# EasyEDA Pro project 课设作业.eprj, board PCB1
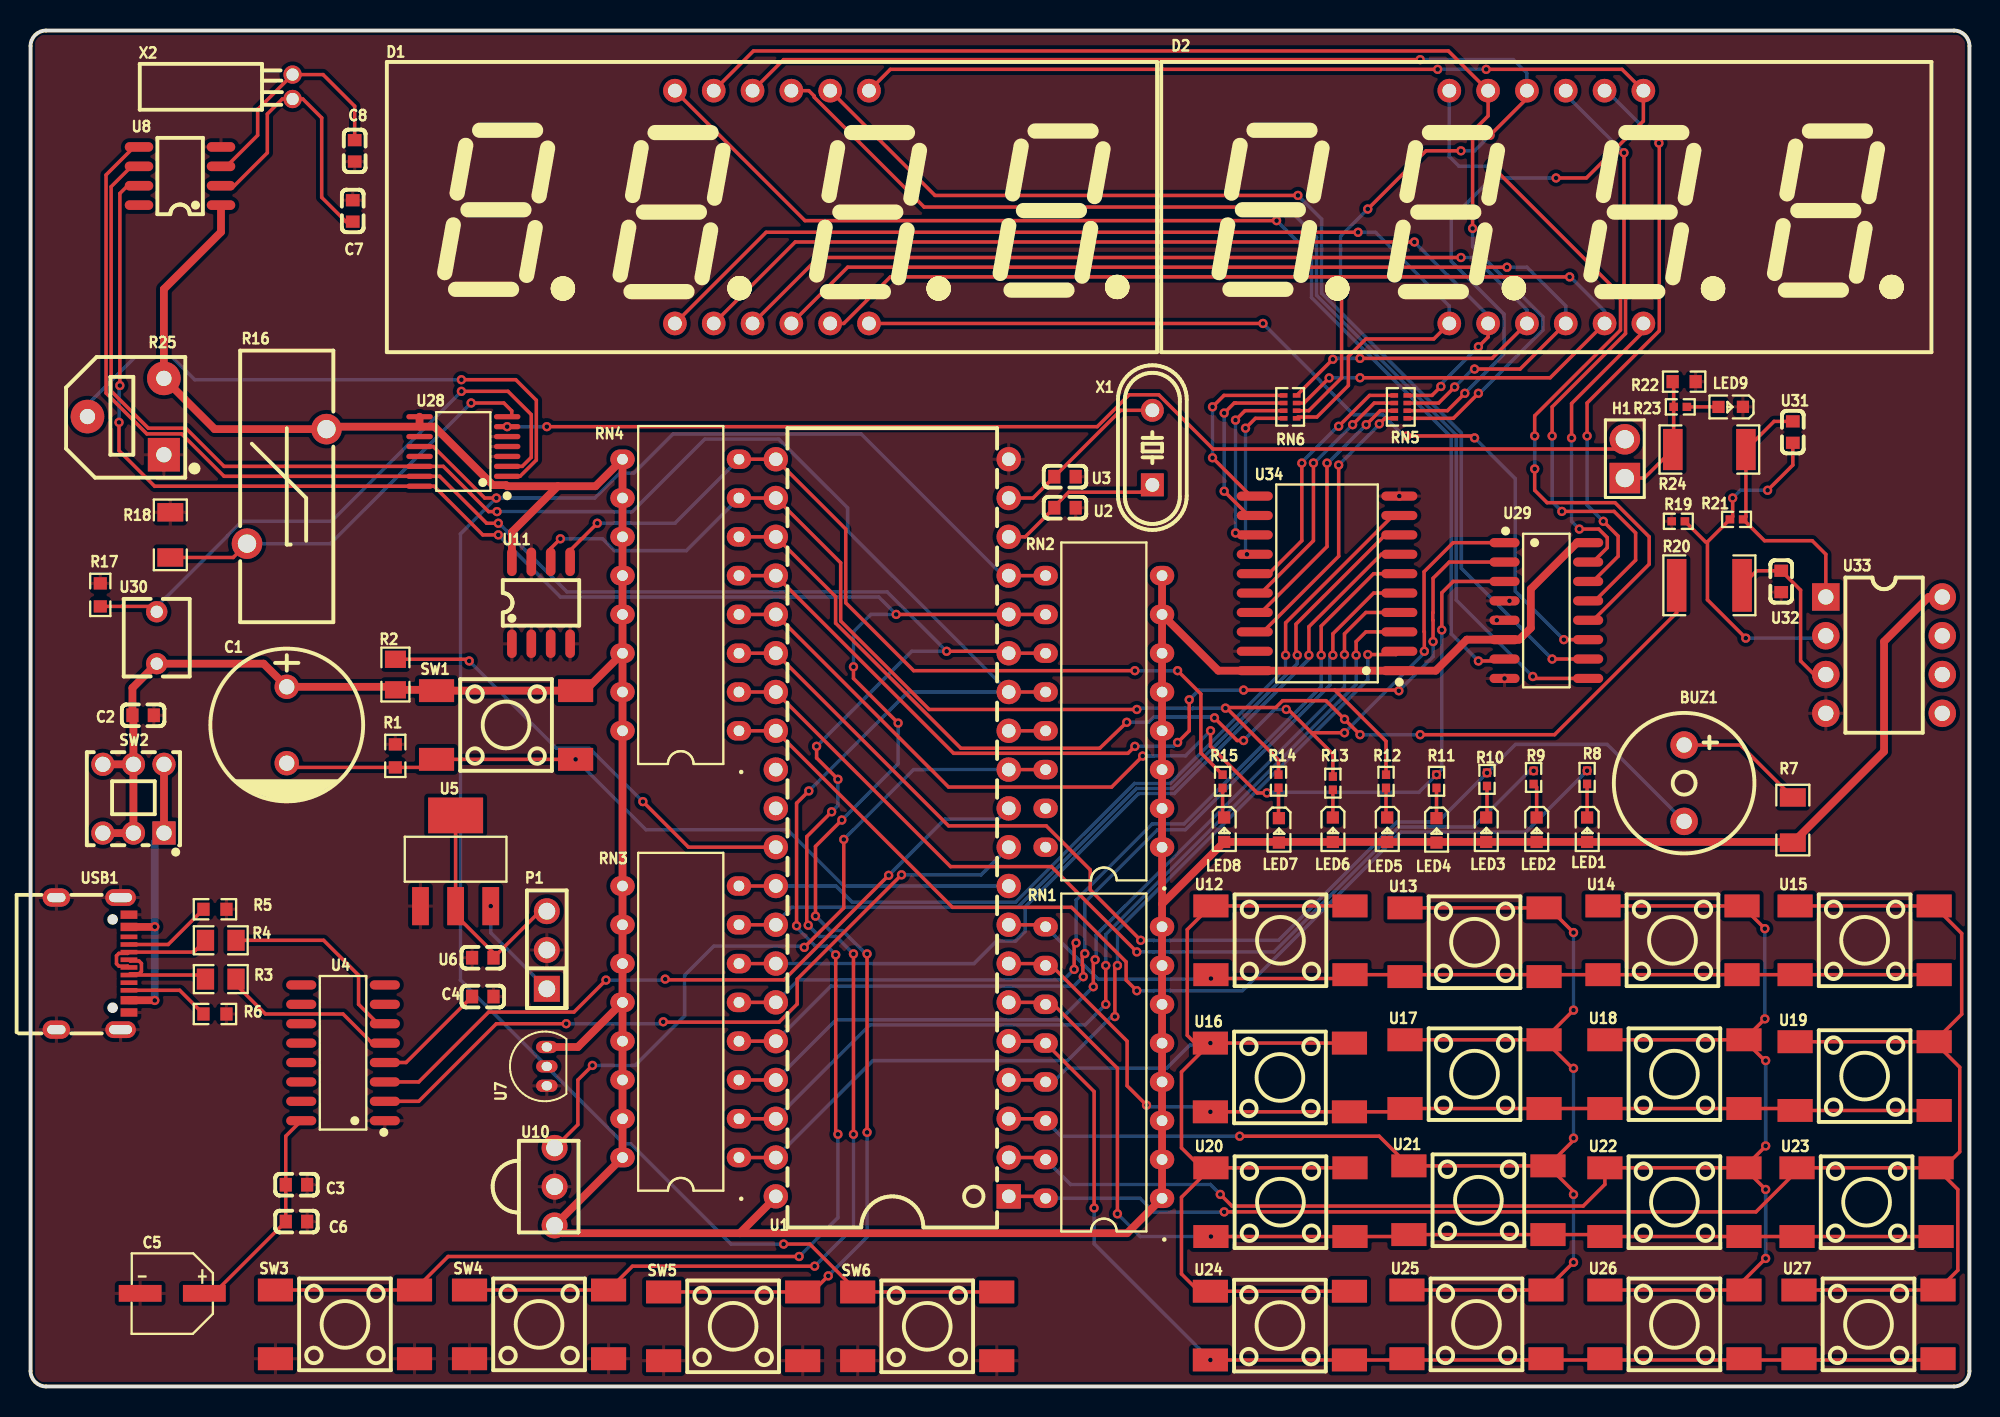
[diagram p1: board, top side]
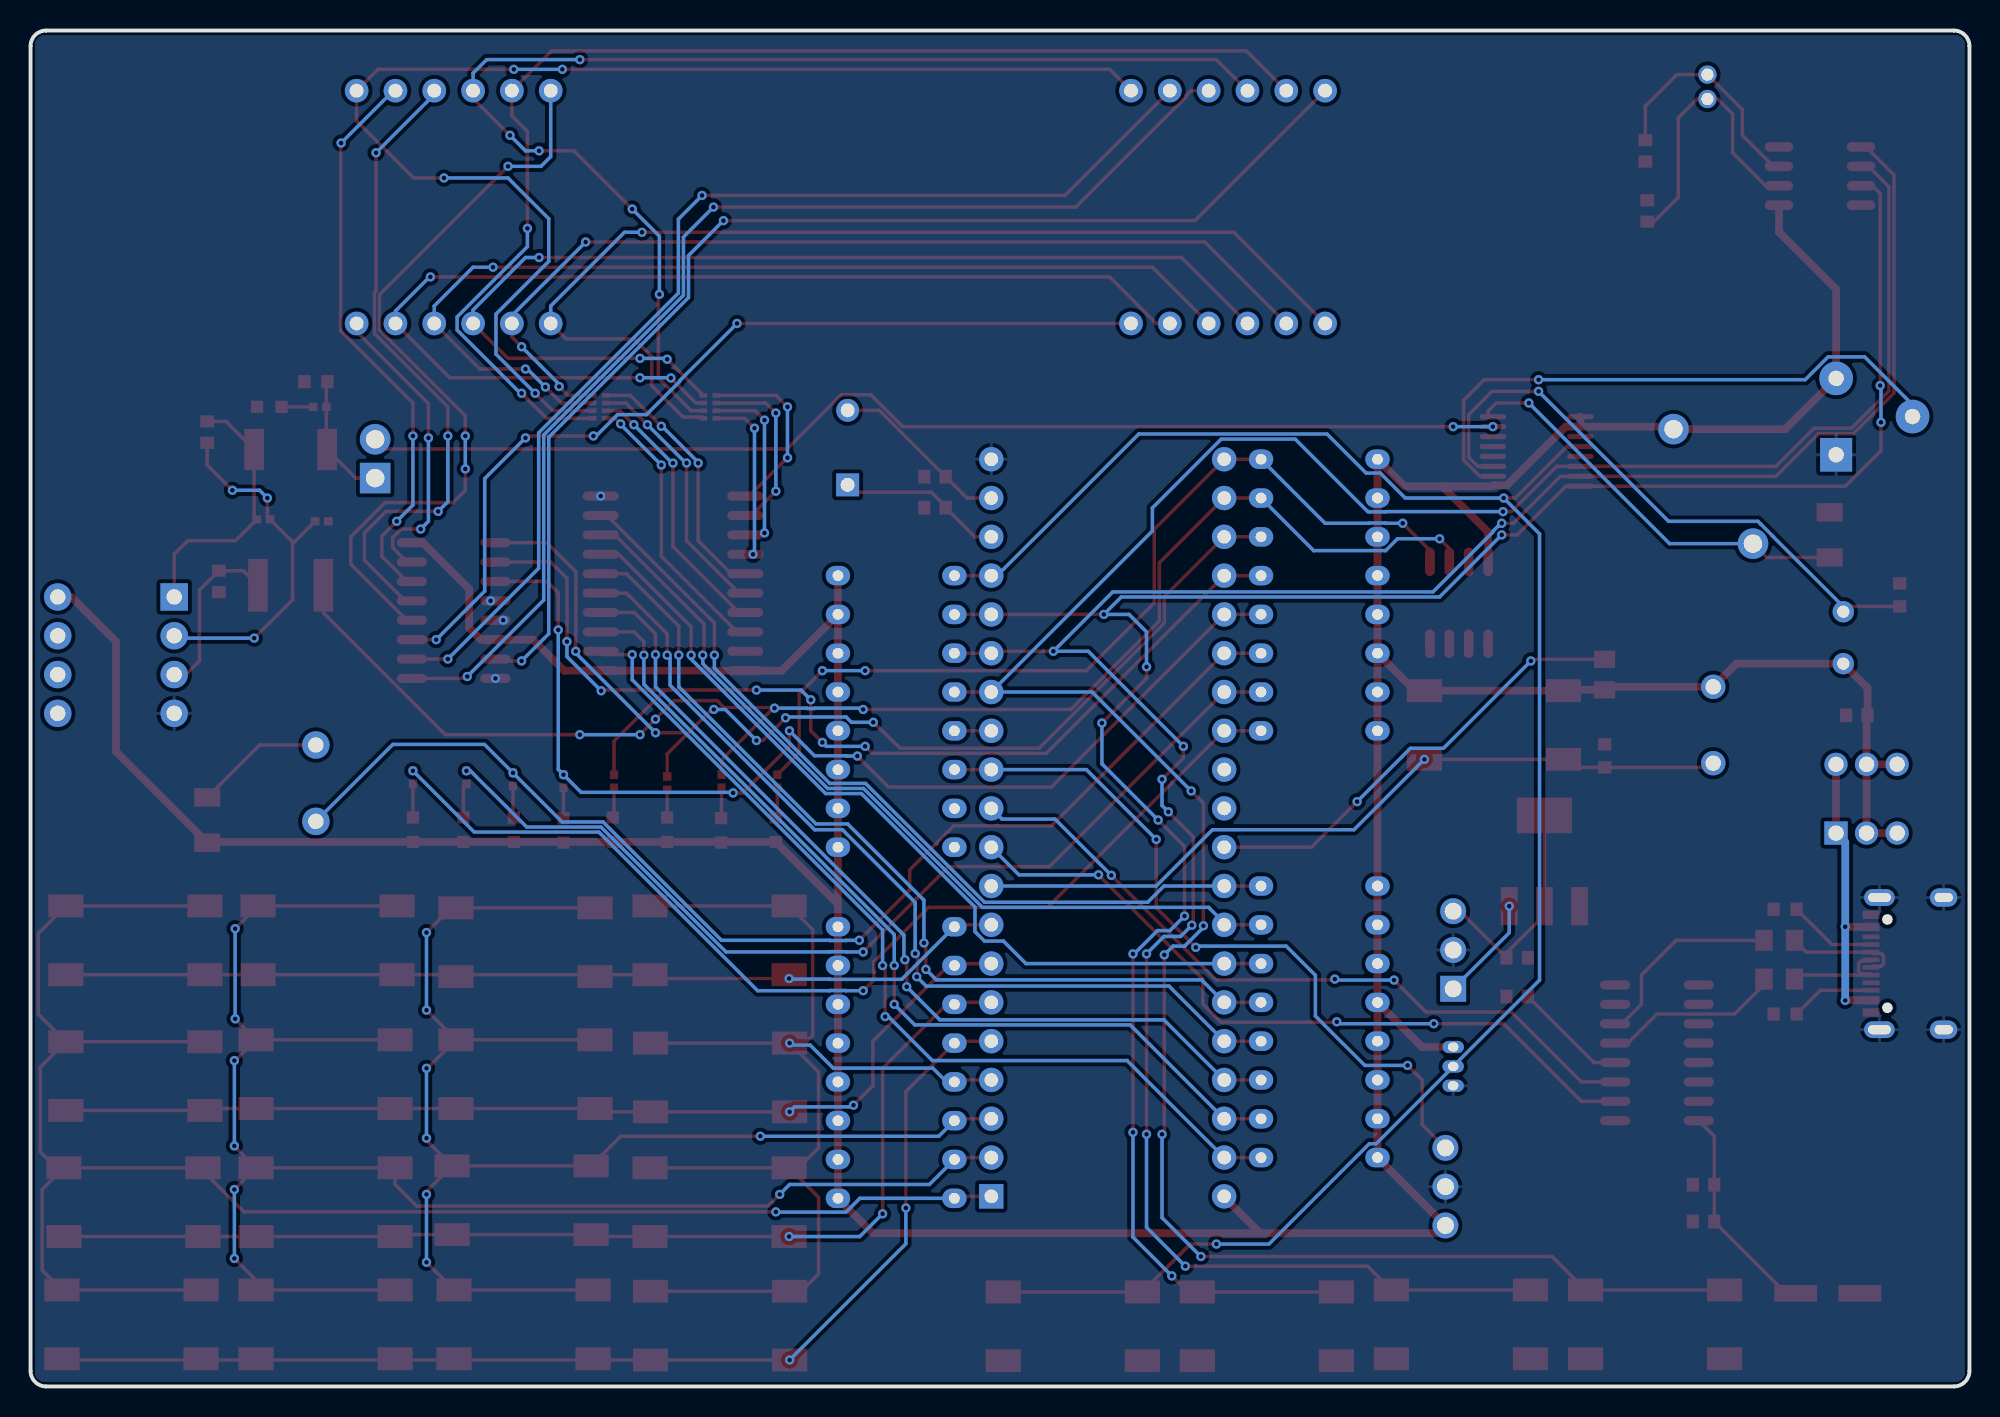
[diagram p2: board, bottom side, seen from below]

Outline 126.87 x 88.77 mm; copper layers: Top Layer, Bottom Layer. Coordinates in mm from the lower left corner of the outline.
Outline path: 0,87.76 0,1.02 arc(0.3,0.3) 1.02,0 125.86,0 arc(126.58,0.3) 126.87,1.02 126.87,87.76 arc(126.58,88.48) 125.86,88.77 1.02,88.77 arc(0.3,88.48) 0,87.76
Stack: Top Layer 0.035mm / Dielectric1 1.51mm FR4 er 4.5 / Bottom Layer 0.035mm

## Design rules (mm)
template: JLCPCB Capability(Two Layers Board)
spacing copperThickness1oz (default): track to track 0.102, other pairs 0.152 to 0.3
spacing copperThickness2oz: track to track 0.203, other pairs 0.152 to 0.3
track width copperThickness1oz (default): min 0.127, default 0.254, max 2.54
track width copperThickness2oz: min 0.203, default 0.254, max 2.54
differential pair differentialPair (default): width min 0.127, default 0.254, max 2.54; gap min 0.152, default 0.152
via viaSize (default): diameter min 0.5, default 0.61, max 10; hole min 0.3, default 0.305, max 6.3

## Placement (name value [footprint] x y rotation side)
BUZ1  蜂鸣器  [BUZ-TH_BD9.0-P5.00-D0.6-FD]  108.2 39.5 270 top
C1  10uF  [CAP-TH_BD10.0-P5.00-D0.6-FD_1]  16.76 43.31 270 top
C2  100nF  [C0603]  7.37 43.94 0 top
C3  100nF  [C0603]  17.4 13.21 0 top
C4  10nF  [C0603]  29.59 25.53 0 top
C5  22uF  [CAP-SMD_BD5.0-L5.3-W5.3-LS6.0-FD-H5.7]  9.27 6.1 180 top
C6  100nF  [C0603]  17.4 10.8 180 top
C7  22pF  [C0603]  21.08 76.96 90 top
C8  22pF  [C0603]  21.21 80.9 270 top
D1  FJ5461AH 红色  [LED-SEG-TH_FJ5461AH]  48.51 77.22 0 top
D2  FJ5461AH 红色  [LED-SEG-TH_FJ5461AH]  99.19 77.22 0 top
H1  PZ254V-11-02P  [HDR-TH_2P-P2.54-V-M]  104.32 60.74 90 top
LED1  LTST-C190KSKT  [LED0603-RD]  101.85 36.45 270 top
LED2  LTST-C190KSKT  [LED0603-RD]  98.55 36.45 270 top
LED3  LTST-C190KSKT  [LED0603-RD]  95.25 36.45 270 top
LED4  LTST-C190KSKT  [LED0603-RD]  92 36.41 270 top
LED5  LTST-C190KSKT  [LED0603-RD]  88.77 36.45 270 top
LED6  LTST-C190KSKT  [LED0603-RD]  85.22 36.45 270 top
LED7  LTST-C190KSKT  [LED0603-RD]  81.69 36.41 270 top
LED8  LTST-C190KSKT  [LED0603-RD]  78.1 36.45 270 top
LED9  XL-1608SURC-06  [LED0603-RD_RED]  111.25 64.14 180 top
P1  TXM_3  [HDR-TH_3P-P2.54-V-M-A]  33.78 28.58 90 top
R1  10K  [R0603]  23.87 41.28 90 top
R2  4.7kΩ  [R0805]  23.88 46.61 270 top
R3  27Ω  [R0805]  12.45 26.67 0 top
R4  27Ω  [R0805]  12.45 29.21 0 top
R5  5.1kΩ  [R0603]  12.06 31.24 0 top
R6  5.1kΩ  [R0603]  12.06 24.38 0 top
R7  100Ω  [R1206]  115.32 37.08 270 top
R8  470Ω  [R0402]  101.85 39.88 270 top
R9  470Ω  [R0402]  98.35 39.87 270 top
R10  470Ω  [R0402]  95.3 39.75 270 top
R11  470Ω  [R0402]  92 39.62 270 top
R12  470Ω  [R0402]  88.7 39.62 270 top
R13  470Ω  [R0402]  85.22 39.5 270 top
R14  470Ω  [R0402]  81.66 39.62 270 top
R15  470Ω  [R0402]  78 39.62 270 top
R16  WTR15D050MC3BW  [RES-TH_L17.5-W6.0-P7.50-D0.8-S5.20]  16.76 58.93 90 top
R17  10K  [R0603]  4.56 51.82 270 top
R18  100kΩ  [R1206]  9.14 55.75 270 top
R19  470Ω  [R0402]  107.82 56.64 0 top
R20  51kΩ  [R1812]  109.85 52.45 0 top
R21  470Ω  [R0402]  111.63 56.77 0 top
R22  4.7kΩ  [R0603]  108.2 65.79 180 top
R23  470Ω  [R0402]  107.95 64.14 180 top
R24  330Ω  [R2010]  109.85 61.34 180 top
R25  10kΩ  [RES-ADJ-SMD_RM065-V1]  6.22 63.5 90 top
RN1  10kΩ  [DIP-16_L22.0-W6.7-P2.54-LS7.6-BL]  70.23 21.21 90 top
RN2  10kΩ  [DIP-16_L22.0-W6.7-P2.54-LS7.6-BL]  70.23 44.2 90 top
RN3  10kΩ  [DIP-16_L22.0-W6.7-P2.54-LS7.6-BL]  42.55 23.88 90 top
RN4  10kΩ  [DIP-16_L22.0-W6.7-P2.54-LS7.6-BL]  42.55 51.82 90 top
RN5  100Ω  [RES-ARRAY-SMD_0402-8P-L2.0-W1.0-BL]  89.66 64.14 90 top
RN6  100Ω  [RES-ARRAY-SMD_0402-8P-L2.0-W1.0-BL]  82.42 64.14 90 top
SW1  KH-6X6X5H-STM  [SW-SMD_4P-L6.0-W6.0-P4.50-LS9.0_H5.0]  31.11 43.31 0 top
SW2  5.8 ZSGT  [SW-TH_5.8ZSGT]  6.73 38.48 0 top
SW3  KH-6X6X5H-STM  [SW-SMD_4P-L6.0-W6.0-P4.50-LS9.0_H5.0]  20.57 4.06 0 top
SW4  KH-6X6X5H-STM  [SW-SMD_4P-L6.0-W6.0-P4.50-LS9.0_H5.0]  33.27 4.06 0 top
SW5  KH-6X6X5H-STM  [SW-SMD_4P-L6.0-W6.0-P4.50-LS9.0_H5.0]  45.97 3.94 0 top
SW6  KH-6X6X5H-STM  [SW-SMD_4P-L6.0-W6.0-P4.50-LS9.0_H5.0]  58.67 3.94 0 top
U1  STC89C52RC-40I-PDIP40  [DIP-40_L52.0-W13.7-P2.54-LS15.2-BL]  56.39 36.58 90 top
U2  33pF  [C0603]  67.69 57.53 180 top
U3  33pF  [C0603]  67.69 59.56 0 top
U4  CH340G  [SOIC-16_L9.9-W3.9-P1.27-LS6.0-BL]  20.45 21.84 90 top
U5  AMS1117-3.3  [SOT-223-3_L6.5-W3.4-P2.30-LS7.0-BR]  27.81 34.42 270 top
U6  100nF  [C0603]  29.59 28.07 0 top
U7  DS18B20  [TO-92-3_L4.6-W3.6-P1.27-L-1]  33.78 20.96 90 top
U8  DS1302-TD  [SOP-8_L4.9-W3.9-P1.27-LS6.0-BL]  9.78 79.25 90 top
U10  HS0038B  [OPTO-TH_HS0038B-A]  34.29 13.08 90 top
U11  24C02  [SOP-8_L4.9-W3.9-P1.27-LS6.0-BL]  33.4 51.31 0 top
U12  按键  [SW-SMD_4P-L6.0-W6.0-P4.50-LS9.0-2]  81.79 29.21 0 top
U13  按键  [SW-SMD_4P-L6.0-W6.0-P4.50-LS9.0-2]  94.49 29.08 0 top
U14  按键  [SW-SMD_4P-L6.0-W6.0-P4.50-LS9.0-2]  107.44 29.21 0 top
U15  按键  [SW-SMD_4P-L6.0-W6.0-P4.50-LS9.0-2]  120.01 29.21 0 top
U16  按键  [SW-SMD_4P-L6.0-W6.0-P4.50-LS9.0-2]  81.75 20.23 0 top
U17  按键  [SW-SMD_4P-L6.0-W6.0-P4.50-LS9.0-2]  94.49 20.45 0 top
U18  按键  [SW-SMD_4P-L6.0-W6.0-P4.50-LS9.0-2]  107.57 20.45 0 top
U19  按键  [SW-SMD_4P-L6.0-W6.0-P4.50-LS9.0-2]  120.01 20.32 0 top
U20  按键  [SW-SMD_4P-L6.0-W6.0-P4.50-LS9.0-2]  81.79 12.07 0 top
U21  按键  [SW-SMD_4P-L6.0-W6.0-P4.50-LS9.0-2]  94.74 12.19 0 top
U22  按键  [SW-SMD_4P-L6.0-W6.0-P4.50-LS9.0-2]  107.57 12.07 0 top
U23  按键  [SW-SMD_4P-L6.0-W6.0-P4.50-LS9.0-2]  120.14 12.07 0 top
U24  按键  [SW-SMD_4P-L6.0-W6.0-P4.50-LS9.0-2]  81.75 3.98 0 top
U25  按键  [SW-SMD_4P-L6.0-W6.0-P4.50-LS9.0-2]  94.62 4.06 0 top
U26  按键  [SW-SMD_4P-L6.0-W6.0-P4.50-LS9.0-2]  107.57 4.06 0 top
U27  按键  [SW-SMD_4P-L6.0-W6.0-P4.50-LS9.0-2]  120.27 4.06 0 top
U28  XPT2046  [TSSOP-16_L5.0-W4.4-P0.65-LS6.4-BL]  28.32 61.21 90 top
U29  74HC138  [SOIC-16_L9.9-W3.9-P1.27-LS6.0-BL]  99.19 50.8 270 top
U30  光敏电阻-5MM  [RES-TH_L4.9-W4.3-P3.4]  8.25 49.02 90 top
U31  100nF  [C0603]  115.32 62.48 90 top
U32  100nF  [C0603]  114.55 52.71 90 top
U33  LM358P  [DIP-8_L9.7-W6.4-P2.54-LS7.6-BL]  121.28 47.88 270 top
U34  74HC245D653  [SOIC-20_L13.0-W7.6-P1.27-LS10.3-BL]  84.84 52.58 90 top
USB1  TYPE-C 16PIN 2MD(073)  [USB-C-SMD_TYPE-C-6PIN-2MD-073]  4.06 27.69 270 top
X1  11.0592MHz  [HC-49US_L11.5-W4.5-P4.88]  73.41 61.47 90 top
X2  32.768kHz  [OSC-TH_BD3.1-P0.8-D0.3]  17.14 85.09 0 top

## Footprints (pads in the part's own frame, mm; a bottom-side part is the same pattern mirrored in y, then rotated)
BUZ-TH_BD9.0-P5.00-D0.6-FD
  round 1.8 hole 1: 1(-2.5,0) 2(2.5,0)
C0603
  rect 0.8x0.9 smd: 1(-0.7,0) 2(0.7,0)
CAP-SMD_BD5.0-L5.3-W5.3-LS6.0-FD-H5.7
  rect 2.8x1.1 smd: 1(-2.1,0) 2(2.1,0)
CAP-TH_BD10.0-P5.00-D0.6-FD_1
  round 1.6 hole 1: 1(-2.5,0) 2(2.5,0)
DIP-8_L9.7-W6.4-P2.54-LS7.6-BL
  rect 1.8x1.8 hole 1: 1(-3.81,-3.81)
  round 1.8 hole 1: 2(-1.27,-3.81) 3(1.27,-3.81) 4(3.81,-3.81) 5(3.81,3.81) 6(1.27,3.81) 7(-1.27,3.81) 8(-3.81,3.81)
DIP-16_L22.0-W6.7-P2.54-LS7.6-BL
  oval 1.276x1.595 hole 0.7: 1(-8.89,-3.81) 2(-6.35,-3.81) 3(-3.81,-3.81) 4(-1.27,-3.81) 5(1.27,-3.81) 6(3.81,-3.81) 7(6.35,-3.81) 8(8.89,-3.81) 9(8.89,3.81) 10(6.35,3.81) 11(3.81,3.81) 12(1.27,3.81) 13(-1.27,3.81) 14(-3.81,3.81) 15(-6.35,3.81) 16(-8.89,3.81)
DIP-40_L52.0-W13.7-P2.54-LS15.2-BL
  rect 1.6x1.6 hole 0.889: 1(-24.13,-7.62)
  round 1.6 hole 0.889: 2(-21.59,-7.62) 3(-19.05,-7.62) 4(-16.51,-7.62) 5(-13.97,-7.62) 6(-11.43,-7.62) 7(-8.89,-7.62) 8(-6.35,-7.62) 9(-3.81,-7.62) 10(-1.27,-7.62) 11(1.27,-7.62) 12(3.81,-7.62) 13(6.35,-7.62) 14(8.89,-7.62) 15(11.43,-7.62) 16(13.97,-7.62) 17(16.51,-7.62) 18(19.05,-7.62) 19(21.59,-7.62) 20(24.13,-7.62) 21(24.13,7.62) 22(21.59,7.62) 23(19.05,7.62) 24(16.51,7.62) 25(13.97,7.62) 26(11.43,7.62) 27(8.89,7.62) 28(6.35,7.62) 29(3.81,7.62) 30(1.27,7.62) 31(-1.27,7.62) 32(-3.81,7.62) 33(-6.35,7.62) 34(-8.89,7.62) 35(-11.43,7.62) 36(-13.97,7.62) 37(-16.51,7.62) 38(-19.05,7.62) 39(-21.59,7.62) 40(-24.13,7.62)
HC-49US_L11.5-W4.5-P4.88
  rect 1.5x1.5 hole 0.9: 1(-2.44,0)
  round 1.5 hole 0.9: 2(2.44,0)
HDR-TH_2P-P2.54-V-M
  rect 2x2 hole 1.2: 1(-1.27,0)
  round 2 hole 1.2: 2(1.27,0)
HDR-TH_3P-P2.54-V-M-A
  rect 1.7x1.7 hole 1.1: 1(-2.54,0)
  round 1.7 hole 1.1: 2(0,0) 3(2.54,0)
LED0603-RD
  rect 0.8x0.8 smd: 1(-0.799,0) 2(0.799,0)
LED0603-RD_RED
  rect 0.8x0.8 smd: 1(-0.799,-0.004) 2(0.799,0.004)
LED-SEG-TH_FJ5461AH
  round 1.55 hole 0.9: 1(-6.35,-7.62) 2(-3.81,-7.62) 3(-1.27,-7.62) 4(1.27,-7.62) 5(3.81,-7.62) 6(6.35,-7.62) 7(6.35,7.62) 8(3.81,7.62) 9(1.27,7.62) 10(-1.27,7.62) 11(-3.81,7.62) 12(-6.35,7.62)
OPTO-TH_HS0038B-A
  round 1.7 hole 1.1: 1(2.54,0) 2(0,0) 3(-2.54,0)
OSC-TH_BD3.1-P0.8-D0.3
  round 1.2 hole 0.8: 1(0,0.8) 2(0,-0.8)
R0402
  rect 0.566x0.54 smd: 1(-0.433,0) 2(0.433,0)
R0603
  rect 0.806x0.864 smd: 1(-0.753,0) 2(0.753,0)
R0805
  rect 1.133x1.377 smd: 1(-1,0) 2(1,0)
R1206
  rect 1.208x1.701 smd: 1(-1.479,0) 2(1.479,0)
R1812
  rect 1.282x3.456 smd: 1(-2.141,0) 2(2.141,0)
R2010
  rect 1.282x2.7 smd: 1(-2.391,0) 2(2.391,0)
RES-ADJ-SMD_RM065-V1
  rect 2.2x2.1 hole 1: 1(-2.5,-2.5)
  round 2.2 hole 1: 2(0,2.5) 3(2.5,-2.5)
RES-ARRAY-SMD_0402-8P-L2.0-W1.0-BL
  rect 0.3x0.505 smd: 1(-0.75,0.427) 2(-0.25,0.427) 3(0.25,0.427) 4(0.75,0.427) 5(0.75,-0.427) 6(0.25,-0.427) 7(-0.25,-0.427) 8(-0.75,-0.427)
RES-TH_L4.9-W4.3-P3.4
  round 1.4 hole 0.8: 1(-1.7,0) 2(1.7,0)
RES-TH_L17.5-W6.0-P7.50-D0.8-S5.20
  round 2 hole 1.2: 1(-3.749,2.6) 2(3.749,-2.6)
SOIC-16_L9.9-W3.9-P1.27-LS6.0-BL
  oval 0.602x1.971 smd: 1(-4.445,-2.736) 2(-3.175,-2.736) 3(-1.905,-2.736) 4(-0.635,-2.736) 5(0.635,-2.736) 6(1.905,-2.736) 7(3.175,-2.736) 8(4.445,-2.736) 9(4.445,2.736) 10(3.175,2.736) 11(1.905,2.736) 12(0.635,2.736) 13(-0.635,2.736) 14(-1.905,2.736) 15(-3.175,2.736) 16(-4.445,2.736)
SOIC-20_L13.0-W7.6-P1.27-LS10.3-BL
  oval 0.595x2.36 smd: 1(-5.715,-4.73) 2(-4.445,-4.73) 3(-3.175,-4.73) 4(-1.905,-4.73) 5(-0.635,-4.73) 6(0.635,-4.73) 7(1.905,-4.73) 8(3.175,-4.73) 9(4.445,-4.73) 10(5.715,-4.73) 11(5.715,4.73) 12(4.445,4.73) 13(3.175,4.73) 14(1.905,4.73) 15(0.635,4.73) 16(-0.635,4.73) 17(-1.905,4.73) 18(-3.175,4.73) 19(-4.445,4.73) 20(-5.715,4.73)
SOP-8_L4.9-W3.9-P1.27-LS6.0-BL
  oval 0.63x1.865 smd: 1(-1.905,-2.683) 2(-0.635,-2.683) 3(0.635,-2.683) 4(1.905,-2.683) 5(1.905,2.683) 6(0.635,2.683) 7(-0.635,2.683) 8(-1.905,2.683)
SOT-223-3_L6.5-W3.4-P2.30-LS7.0-BR
  rect 2.5x1.1 smd: 1(2.97,-2.3) 2(2.97,0) 3(2.97,2.3)
  rect 2.34x3.6 smd: 4(-2.97,0)
SW-SMD_4P-L6.0-W6.0-P4.50-LS9.0-2
  rect 2.3x1.5 smd: 1(-4.55,2.25) 2(4.55,2.25) 3(-4.55,-2.25) 4(4.55,-2.25)
SW-SMD_4P-L6.0-W6.0-P4.50-LS9.0_H5.0
  rect 2.3x1.5 smd: 1(-4.55,2.25) 2(4.55,2.25) 3(-4.55,-2.25) 4(4.55,-2.25)
SW-TH_5.8ZSGT
  rect 1.524x1.524 hole 1: 1(2,-2.25)
  round 1.524 hole 1: 2(0,-2.25) 3(-2,-2.25) 4(2,2.25) 5(0,2.25) 6(-2,2.25)
TO-92-3_L4.6-W3.6-P1.27-L-1
  oval 0.8x1.4 hole 0.6x0.682: 1(-1.27,0) 2(0,0) 3(1.27,0)
TSSOP-16_L5.0-W4.4-P0.65-LS6.4-BL
  oval 0.343x1.732 smd: 1(-2.275,-2.866) 2(-1.625,-2.866) 3(-0.975,-2.866) 4(-0.325,-2.866) 5(0.325,-2.866) 6(0.975,-2.866) 7(1.625,-2.866) 8(2.275,-2.866) 9(2.275,2.866) 10(1.625,2.866) 11(0.975,2.866) 12(0.325,2.866) 13(-0.325,2.866) 14(-0.975,2.866) 15(-1.625,2.866) 16(-2.275,2.866)
USB-C-SMD_TYPE-C-6PIN-2MD-073
  rect 0.55x1.1 smd: 1(-3.2,2.375) 2(-2.4,2.375) 11(2.4,2.375) 12(3.2,2.375)
  rect 0.3x1.1 smd: 3(-1.75,2.375) 4(-1.25,2.375) 5(-0.75,2.375) 6(-0.25,2.375) 7(0.25,2.375) 8(0.75,2.375) 9(1.25,2.375) 10(1.75,2.375)
  oval 1.1x2 hole 0.6x1.5: 13(-4.325,1.825) 14(4.325,1.825)
  oval 1.2x1.8 hole 0.6x1.2: 13(-4.325,-2.375) 14(4.325,-2.375)

## Nets
As in the schematic.

Pads without a net: RN2 15 16; U1 29 30; U4 7 8 9 10 11 12 13 14 15; U8 8; U28 11 13; U33 5 6 7; USB1 3 9

## Via types
v1: diameter 0.61, hole 0.305, Top Layer to Bottom Layer, 189 vias

## Routing (per net, layer and track width the routed paths; a pad name or vN(x,y) marks a point on that pad's centre or on a via; arc(x,y) is an arc through that point)
D5V: length 19
  Top Layer w0.508: SW2.4 SW2.1 ; USB1.11 8.11,25.29 v1(8.13,25.27) ; USB1.2 8,30.09
  Bottom Layer w0.508: v1(8.13,25.27) v1(8.13,30.1) 8.13,35.63 SW2.1
GND:
  vias: v1(89.57,58.29) v1(95.94,50.17) v1(96.45,46.36) v1(96.77,51.44)
VCC: length 342.8
  Top Layer w0.508: 46.41,10.03 71.75,10.03 RN1.1 RN1.2 RN1.3 RN1.4 RN1.5 RN1.6 RN1.7 RN1.8 74.04,31.59 ; 46.41,10.03 34.8,10.03 U10.3 RN3.16 RN3.15 RN3.14 RN3.12 ; 46.41,10.03 48.77,12.4 U1.40 ; U7.3 35.81,22.23 RN3.12 ; 74.04,31.59 LED8.2 LED6.2 LED5.2 LED3.2 LED2.2 LED1.2 115.27,35.65 R7.2 121.28,41.57 121.28,48.77 124.21,51.69 U33.8 ; 74.04,31.59 RN2.1 RN2.2 RN2.3 RN2.4 RN2.5 RN2.6 RN2.7 ; RN3.12 RN3.10 RN3.9 RN4.16 RN4.14 ; U11.8 31.5,55.94 34.5,58.94 ; RN4.14 36.29,45.56 SW1.2 SW1.1 26.51,45.61 R2.2 23.68,45.81 C1.1 15.25,47.32 U30.1 6.67,45.73 C2.1 6.73,43.88 SW2.5 ; RN4.14 RN4.12 RN4.11 RN4.10 RN4.9 36.97,58.94 34.5,58.94 ; RN2.7 RN2.8 ; RN2.7 77.72,46.86 U34.20 U34.1 91.95,46.86 93.98,48.9 U29.6 97.41,48.9 98.17,49.66 98.17,52.21 101.2,55.25 U29.16 ; U28.10 19.53,62.84 R16.2 12.05,62.68 R25.3 8.72,71.84 12.46,75.58 U8.1 ; U28.10 26.43,62.84 30.25,59.01 31.11,59.01 U28.1 34.5,58.94 ; U28.10 U28.9 ; SW2.6 SW2.5 ; SW2.5 SW2.2 SW2.3
AIN0: length 38.9
  Top Layer w0.229: U28.2 32.03,59.59 33.1,60.66 33.1,64.57 31.75,65.91 v1(28.19,65.91)
  Bottom Layer w0.229: R25.2 3.72,64.28 6.85,67.41 9.25,67.41 10.74,65.91 v1(28.19,65.91)
AIN1: length 39.8
  Top Layer w0.229: v1(28.19,65.15) 31.24,65.15 32.77,63.63 32.77,60.83 32.17,60.24 U28.3 ; R17.2 7.91,51.07 U30.2
  Bottom Layer w0.229: v1(28.19,65.15) 19.69,56.64 13.84,56.64 13.65,56.45 13.64,56.45 12.9,55.7 12.9,55.7 8.25,51.05 U30.2
AIN2: length 27.4
  Top Layer w0.229: R16.1 13.26,54.27 R18.2 ; U28.8 31.48,63.49 31.48,63.87 30.97,64.39 v1(28.83,64.39)
  Bottom Layer w0.229: v1(28.83,64.39) 19.62,55.18 R16.1
AIN3: length 75.7
  Top Layer w0.229: v1(33.78,62.84) 69.8,62.84 71.88,64.92 73.83,64.92 77.38,61.37 103.68,61.37 H1.2
  Bottom Layer w0.229: v1(31.19,62.84) v1(33.78,62.84)
D3.3: length 15.1
  Top Layer w0.229: P1.3 33.34,31.12 U6.2 30.29,28.39 27.81,30.87 U5.2 U5.4
DAC1: length 8.4
  Top Layer w0.229: H1.1 105.6,59.47 R24.2 107.52,61.39 R23.2 107.52,65.72 R22.2
DIN5V: length 6.9
  Bottom Layer w0.229: v1(30.11,31.45) 30.11,29.7 P1.1
DN: length 7.7
  Top Layer w0.229: R4.1 10.67,28.44 USB1.5 6.36,28.35 5.78,28.35 5.62,28.2 5.62,27.68 5.78,27.52 6.35,27.52 USB1.7
DP: length 7.5
  Top Layer w0.229: R3.1 11.18,26.94 USB1.8 6.52,27.02 7.1,27.02 7.26,27.18 7.26,27.7 7.1,27.85 6.52,27.85 USB1.6
LED1: length 20
  Top Layer w0.229: v1(101.35,56.13) 102.62,56.13 103.17,55.58 103.17,54.91 102.23,53.98 U29.15 ; 105.54,69.6 105.54,69.06 100.84,64.36 v1(100.84,62.1)
  Bottom Layer w0.229: v1(101.35,56.13) 100.84,56.64 v1(100.84,62.1)
LED2: length 37.5
  Top Layer w0.229: v1(101.85,62.23) 101.85,64.39 106.58,69.11 106.58,81.38 v1(106.55,81.41) ; v1(102.91,56.64) 103.89,55.67 103.89,54.36 102.23,52.71 U29.14
  Bottom Layer w0.229: v1(106.55,81.41) 103.12,84.84 103,84.84 ; v1(102.91,56.64) 101.85,57.7 v1(101.85,62.23)
LED3: length 42.8
  Top Layer w0.229: v1(99.57,62.23) 99.57,64.14 104.37,68.94 104.37,71.61 104.27,71.71 v1(104.27,80.77) ; U29.13 102.36,51.44 105.03,54.1 105.03,55.88 103.62,57.29 v1(100.2,57.29)
  Bottom Layer w0.229: v1(104.27,80.77) 100.46,84.58 100.46,84.84 ; v1(100.2,57.29) 99.57,57.93 v1(99.57,62.23)
LED4: length 50.5
  Top Layer w0.229: U29.12 102.25,50.17 105.92,53.84 105.92,55.63 103.68,57.86 99.24,57.86 98.42,58.67 v1(98.42,60.07) ; v1(95.63,79.88) 104.04,71.48 104.04,69.16 98.42,63.55 v1(98.42,62.23)
  Bottom Layer w0.229: v1(95.63,79.88) 93.47,79.88 92.84,80.52 92.84,84.84 ; v1(98.42,62.23) v1(98.42,60.07)
LED5: length 60
  Top Layer w0.229: U29.11 v1(100.33,48.9) ; v1(94.49,62.1) 94.36,62.23 v1(90.04,62.23) ; 54.86,69.6 v1(80.64,69.6)
  Bottom Layer w0.229: v1(94.49,62.1) 97.16,59.44 97.16,52.07 v1(100.33,48.9) ; v1(90.04,62.23) 89.86,62.23 88.46,63.63 86.57,63.63 84.4,65.79 84.4,65.84 v1(80.64,69.6)
LED6: length 73
  Top Layer w0.229: 52.32,84.84 59.18,77.98 v1(82.93,77.98) ; U29.10 v1(99.57,47.63)
  Bottom Layer w0.229: v1(82.93,77.98) 84.48,76.43 84.48,71.58 93.62,62.44 93.62,53.57 v1(99.57,47.63)
LED7: length 76.6
  Top Layer w0.229: U29.9 98.3,46.36 ; v1(82.19,77.22) 58.47,77.22 51.28,84.4 51.28,84.48 50.93,84.84 49.78,84.84
  Bottom Layer w0.229: v1(98.3,46.48) 93.29,51.49 93.29,62.3 84.15,71.44 84.15,75.25 v1(82.19,77.22)
LED8: length 79
  Top Layer w0.229: U29.7 96.32,47.5 v1(94.74,47.5) ; 42.16,84.84 50.67,76.33 v1(81.53,76.33)
  Bottom Layer w0.229: v1(94.74,47.5) 92.96,49.28 92.96,62.15 83.82,71.29 83.82,74.04 v1(81.53,76.33)
P0.0: length 61.1
  Top Layer w0.229: v1(87.5,47.92) 89.35,47.92 U34.2 ; RN3.1 U1.39 ; v1(71.12,27.56) 70.95,27.39 v1(70.95,24.22)
  Bottom Layer w0.229: v1(87.5,47.92) 87.5,46.27 71.12,29.88 v1(71.12,27.56) ; v1(70.95,24.22) 70.74,24.22 67.86,21.34 55.12,21.34 U1.39
P0.1: length 60.7
  Top Layer w0.229: v1(86.74,47.88) 86.74,48.77 87.38,49.4 U34.3 ; RN3.2 U1.38 ; v1(70.36,27.56) v1(70.36,25.02)
  Bottom Layer w0.229: U1.38 54.91,23.67 69.01,23.67 v1(70.36,25.02) ; v1(86.74,47.88) 86.74,45.97 70.36,29.59 v1(70.36,27.56)
P0.2: length 59.8
  Top Layer w0.229: v1(69.54,26.17) 69.54,27.82 v1(69.66,27.94) ; v1(85.98,47.91) 85.98,49.28 87.38,50.67 U34.4 ; RN3.3 U1.37
  Bottom Layer w0.229: v1(69.54,26.17) 67.37,24 52.7,24 U1.37 ; v1(69.66,27.94) 69.72,28 69.72,29.55 85.98,45.81 v1(85.98,47.91)
P0.3: length 60.1
  Top Layer w0.229: v1(85.22,47.88) 85.22,49.28 87.88,51.94 U34.5 ; v1(68.99,28.34) 68.82,28.18 68.82,27.58 68.86,27.54 68.86,27.07 68.89,27.04 v1(68.89,26.83) ; 46.35,22.61 U1.36
  Bottom Layer w0.229: v1(85.22,47.88) 85.03,47.69 85.03,45.91 75.56,36.45 73.75,36.45 68.99,31.69 v1(68.99,28.34) ; U1.36 52.37,26.21 68.27,26.21 v1(68.89,26.83)
P0.4: length 59.7
  Top Layer w0.229: v1(84.45,47.88) 84.45,49.78 87.88,53.21 U34.6 ; v1(68.29,27.31) 68.29,28.91 v1(68.41,29.04) ; RN3.5 U1.35
  Bottom Layer w0.229: U1.35 50.24,26.62 67.6,26.62 v1(68.29,27.31) ; v1(84.45,47.88) 84.45,45.81 75.48,36.83 73.41,36.83 68.41,31.84 v1(68.41,29.04)
P0.5: length 56.5
  Top Layer w0.229: v1(83.65,47.88) 83.65,49.74 88.39,54.48 U34.7 ; 46.35,27.69 U1.34
  Bottom Layer w0.229: v1(83.65,47.88) 83.69,47.84 83.69,47.66 74.85,38.82 72.51,38.82 65.07,31.39 65.07,29.78 64.45,29.16 63.21,29.16 61.74,27.69 U1.34
P0.6: length 55.5
  Top Layer w0.229: v1(82.89,47.88) 82.8,47.96 82.8,49.91 88.65,55.75 U34.8 ; RN3.7 U1.33
  Bottom Layer w0.229: v1(82.89,47.88) 82.89,47.33 74.71,39.15 72.37,39.15 64.59,31.37 49.78,31.37 48.77,30.35 U1.33
P0.7: length 55.9
  Top Layer w0.229: U34.9 89.16,57.02 82.13,49.99 v1(82.13,47.88) ; RN3.8 U1.32
  Bottom Layer w0.229: U1.32 52.7,32.77 53.77,31.7 64.45,31.7 72.23,39.48 74.57,39.48 82.13,47.03 v1(82.13,47.88)
P1.0: length 119.1
  Top Layer w0.229: 124.69,14.32 U23.1 115.59,14.12 112.9,11.43 v1(78.1,11.43) ; U19.2 126.37,24.37 126.37,29.66 U15.2 U15.1 ; U19.2 U19.1 ; U19.2 126.24,20.9 126.24,15.37 125.19,14.32 U23.2 126.11,12.9 126.11,7.61 U27.2 U27.1 ; RN1.16 66.29,12.45 U1.1
  Bottom Layer w0.229: RN1.16 72.6,12.32 73.51,11.41 78.09,11.41 v1(78.1,11.43)
P1.1: length 107.1
  Top Layer w0.229: U22.2 U22.1 103.02,13.23 101.6,11.81 78.61,11.81 v1(77.85,12.57) ; U22.2 113.54,15.73 v1(113.54,15.75) ; U22.2 v1(113.54,12.9) ; U18.2 113.48,21.34 v1(113.54,21.34) ; U18.2 U18.1 ; U18.2 113.48,24.06 v1(113.48,24.07) ; v1(113.48,29.97) 112,31.46 U14.2 ; v1(113.54,8.38) 112.12,6.96 U26.2 U26.1 ; RN1.15 66.29,14.99 U1.2 ; U14.1 111.99,31.46
  Bottom Layer w0.229: v1(113.54,21.34) v1(113.54,15.75) ; v1(113.48,29.97) v1(113.48,24.07) ; v1(77.85,12.57) 77.2,13.22 68.06,13.22 RN1.15 ; v1(113.54,12.9) v1(113.54,8.38)
P1.2: length 93.6
  Top Layer w0.229: U17.1 99.04,22.7 ; 99.04,22.7 100.91,20.83 v1(100.97,20.83) ; 99.04,22.7 99.04,22.71 v1(100.97,24.64) ; U1.3 66.29,17.53 RN1.14 ; U13.1 99.35,31.33 v1(100.97,29.72) ; v1(100.97,8.13) 99.16,6.33 U25.2 U25.1 ; v1(100.97,16.26) 100.97,16.12 U21.2 100.97,12.77 v1(100.97,12.57) ; 99.29,14.44 90.19,14.44 88.25,16.38 v1(79.12,16.38)
  Bottom Layer w0.229: v1(100.97,29.72) v1(100.97,24.64) ; v1(79.12,16.38) 67.44,16.38 RN1.14 ; v1(100.97,12.57) v1(100.97,8.13) ; v1(100.97,20.83) v1(100.97,16.26)
P1.3: length 81.9
  Top Layer w0.229: v1(77.2,22.48) U16.2 ; v1(77.2,22.48) 75.31,20.59 75.31,15.62 76.62,14.32 U20.1 ; v1(77.2,22.48) 76.2,22.48 75.69,22.99 75.69,29.91 U12.1 U12.2 ; U20.1 75.31,12.39 75.31,7.37 76.44,6.23 U24.1 U24.2 ; U20.1 U20.2 ; RN1.13 66.29,20.07 U1.4
  Bottom Layer w0.229: v1(77.2,22.48) 77.2,22.35 77.2,22.35 75.86,22.35 74.35,20.84 67.83,20.84 66.84,19.85 66.51,19.85 RN1.13
P1.4: length 75.3
  Top Layer w0.229: v1(69.6,11.68) 69.6,19.3 RN1.12 66.29,22.61 U1.5 ; U27.4 124.74,1.73 U24.4 v1(77.2,1.73)
  Bottom Layer w0.229: v1(69.6,11.68) 69.6,9.34 v1(77.2,1.73)
P1.5: length 72.7
  Top Layer w0.229: U23.4 U23.3 U22.4 U22.3 102.89,9.94 U21.4 90.19,9.94 90.06,9.82 U20.4 v1(77.24,9.82) ; v1(71.12,11.3) 71.12,20.83 66.93,25.02 RN1.11 66.29,25.15 U1.6
  Bottom Layer w0.229: v1(77.24,9.82) 72.61,9.82 v1(71.12,11.3)
P1.6: length 66.4
  Top Layer w0.229: U1.7 66.29,27.69 RN1.10 66.8,27.56 71.75,22.61 71.75,19.69 v1(73.03,18.42) ; 124.56,18.07 115.47,18.07 115.34,18.2 U18.4 U18.3 U17.3 89.72,17.98 U16.4 v1(77.2,17.98)
  Bottom Layer w0.229: v1(73.03,18.42) 73.14,18.3 76.88,18.3 v1(77.2,17.98)
P1.7: length 62.2
  Top Layer w0.229: v1(77.24,26.71) 86.08,26.71 U12.4 U14.3 U14.4 U15.3 U15.4 ; U1.8 66.29,30.23 RN1.9
  Bottom Layer w0.229: v1(77.24,26.71) 77.2,26.67 74.59,26.67 74.57,26.65 69.87,26.65 RN1.9
P2.0: length 59.6
  Top Layer w0.229: v1(72.26,46.86) 57.78,46.86 53.34,51.31 53.34,56.13 U1.21 RN4.8 ; U11.5 35.31,54.74 v1(37.08,56.52) ; v1(75.06,46.86) 76.58,45.34 76.58,41.47 R15.1
  Bottom Layer w0.229: RN4.8 42.16,56.52 39.28,56.52 39.27,56.53 38.2,56.53 38.19,56.52 v1(37.08,56.52) ; v1(72.26,46.86) v1(75.06,46.86)
P2.1: length 96.6
  Top Layer w0.229: R20.1 107.71,50.66 99.73,42.67 v1(90.93,42.67) ; v1(34.67,55.5) 34.04,54.86 U11.6 ; R14.1 81.66,41.02 78.27,44.41 ; 78.27,44.41 78.31,44.45 81.48,44.45 81.93,44.9 84.77,44.9 v1(85.98,43.69) v1(87,42.67) ; 78.27,44.41 v1(78.19,44.41) ; RN4.7 U1.22 53.01,53.92 53.01,50.11 58.8,44.32 v1(72.39,44.32)
  Bottom Layer w0.229: v1(72.39,44.32) 72.48,44.41 75.56,44.41 75.58,44.39 76.06,44.39 76.08,44.41 v1(78.19,44.41) ; RN4.7 42.91,54.72 38.2,54.72 37.42,55.5 v1(34.67,55.5) ; v1(87,42.67) v1(90.93,42.67)
P2.2: length 71.7
  Top Layer w0.229: 83.82,42.8 v1(85.98,42.8) ; 83.82,42.8 85.22,41.4 85.22,39.93 ; 83.82,42.8 82.29,44.33 v1(82.17,44.33) ; U29.1 93.09,55.25 91.19,53.34 91.19,49.42 91.2,49.4 v1(91.2,48.13) ; v1(77.47,43.77) 78.95,42.29 v1(79.38,42.29) ; RN4.6 U1.23 52.68,51.72 52.68,49.98 60.87,41.78 69.96,41.78 v1(71.73,43.48)
  Bottom Layer w0.229: 82.3,44.2 82.17,44.32 81.41,44.32 v1(79.38,42.29) ; v1(71.73,43.48) 73.16,43.48 73.51,43.83 77.41,43.83 v1(77.47,43.77) ; v1(91.2,48.13) 91.2,48.02 v1(85.98,42.8)
P2.3: length 71.3
  Top Layer w0.229: RN4.5 U1.24 60.4,41.45 71.81,41.45 v1(72.26,41.91) ; 85.34,45.59 v1(79.38,45.59) ; 85.34,45.59 88.7,42.24 R12.1 ; 85.34,45.59 89.49,45.59 v1(89.53,45.55) ; v1(91.77,48.77) 91.77,50.17 91.76,50.18 91.76,50.66 91.77,50.67 91.77,52.91 92.84,53.98 U29.2 ; v1(75.06,42.16) 75.82,42.93 v1(75.82,44.96)
  Bottom Layer w0.229: v1(75.82,44.96) 76.45,45.59 v1(79.38,45.59) ; v1(75.06,42.16) 74.8,41.91 v1(72.26,41.91) ; v1(91.77,48.77) 91.77,47.79 v1(89.53,45.55)
P2.4: length 71.1
  Top Layer w0.229: U29.3 93.09,52.71 92.35,51.96 v1(92.35,49.53) ; v1(80.9,38.86) 80.27,38.86 77.21,41.91 v1(77.21,42.93) ; v1(72.77,41.28) 70.74,39.24 60.07,39.24 U1.25 46.35,50.55
  Bottom Layer w0.229: v1(92.35,49.53) 92.35,40.4 v1(92,40.05) 90.85,38.9 80.94,38.9 v1(80.9,38.86) ; v1(72.77,41.28) 73.49,41.28 73.51,41.29 75.58,41.29 v1(77.21,42.93)
P2.5: length 77.8
  Top Layer w0.229: RN4.3 U1.26 60.07,36.7 66.46,36.7 69.34,33.82 69.34,32.51 v1(72.64,29.21)
  Bottom Layer w0.229: v1(72.64,29.21) 73.49,29.21 73.51,29.19 74.57,29.19 74.59,29.21 81.66,29.21 89.41,36.96 92.09,36.96 v1(95.3,40.17) 97.17,42.04 103.16,42.04 BUZ1.2
P2.6: length 64
  Top Layer w0.229: 46.35,45.47 U1.27 60.2,34.04 66.8,34.04 v1(72.39,28.45)
  Bottom Layer w0.229: v1(98.35,40.31) 98.09,40.31 94.41,36.63 89.54,36.63 81.37,28.45 74.59,28.45 74.57,28.46 73.51,28.46 73.49,28.45 v1(72.39,28.45)
P2.7: length 69.2
  Top Layer w0.229: RN4.1 U1.28 60.32,31.37 68.12,31.37 71.69,27.8 71.69,26.61 v1(72.39,25.91)
  Bottom Layer w0.229: v1(72.39,25.91) 73.49,25.91 73.51,25.92 74.57,25.92 74.59,25.91 79.29,25.91 89.68,36.3 97.84,36.3 v1(101.85,40.31)
P3.2: length 48.4
  Top Layer w0.229: U1.12 RN2.14 ; v1(36.77,21.02) 35.81,20.07 35.81,17.15 U10.1 ; v1(53.21,35.81) 53.21,31.33 v1(50.63,28.75)
  Bottom Layer w0.229: v1(50.63,28.75) 50.55,28.83 44.7,28.83 42.8,26.92 42.8,24.26 39.56,21.02 v1(36.77,21.02) ; U1.12 57.78,40.39 v1(53.21,35.81)
P3.3: length 2.4
  Top Layer w0.229: U1.13 RN2.13
P3.4: length 174.3
  Top Layer w0.229: v1(50.29,8.51) 27.32,8.51 SW3.2 ; U1.14 RN2.12 ; SW3.1 25.12,6.31 ; v1(52.69,28.26) 52.69,16.66 v1(52.83,16.51) ; v1(30.52,57.28) 29.97,57.28 27.01,60.24 U28.14 12.66,60.24 10.16,62.74 7.71,62.74 5.27,65.17 5.27,78.55 6.6,79.88 U8.6 ; v1(50.12,30.16) 50.12,38.19 v1(50.93,38.99)
  Bottom Layer w0.229: v1(50.29,8.51) 52.83,11.05 v1(52.83,16.51) ; v1(52.69,28.26) 52.11,28.83 51.35,28.83 50.12,30.06 v1(50.12,30.16) ; v1(30.52,57.28) 38.19,57.28 38.2,57.26 39.27,57.26 39.28,57.28 39.37,57.28 44.12,62.03 48.96,62.03 53.47,57.52 53.47,56.01 U1.14 57.4,45.47 v1(50.93,38.99)
P3.5: length 158.5
  Top Layer w0.229: v1(51.31,7.87) 39.38,7.87 SW4.2 ; v1(52.42,37.62) 50.79,35.99 50.79,30.29 v1(50.89,30.2) ; v1(53.85,28.32) v1(53.85,16.51) ; SW4.1 37.82,6.31 ; v1(59.94,48.13) 63.88,48.13 U1.15 RN2.11 ; v1(30.61,56.52) 29.84,56.52 26.77,59.59 U28.15 12.66,59.59 9.88,62.37 7.61,62.37 4.94,65.04 4.94,79.32 6.77,81.15 U8.5 ; v1(51.44,41.91) 51.44,41.15 v1(52.83,39.75)
  Bottom Layer w0.229: v1(52.83,39.75) 52.83,38.03 v1(52.42,37.62) ; v1(51.44,41.91) 57.66,48.13 v1(59.94,48.13) 56.06,52.02 35.1,52.02 31.18,55.94 31.18,55.99 30.84,56.32 30.8,56.32 v1(30.61,56.52) ; v1(50.89,30.2) 51.62,29.46 52.7,29.46 v1(53.85,28.32) ; v1(53.85,16.51) 53.85,10.41 v1(51.31,7.87)
P3.6: length 146.6
  Top Layer w0.229: 8.13,58.94 U28.16 26.41,58.94 29.59,55.75 v1(30.61,55.75) ; U8.7 6.97,78.74 6.48,78.74 5.84,78.11 v1(5.84,65.53) ; v1(56.77,43.43) 53.85,46.36 v1(53.85,47.12) ; v1(53.09,37.08) 51.36,35.36 v1(51.36,30.8) ; v1(52.2,7.24) 51.14,6.19 SW5.2 ; RN2.10 U1.16 v1(56.64,50.55) ; v1(5.79,63.12) 5.79,61.27 8.13,58.93 ; SW5.1 50.52,6.19 ; v1(54.74,28.32) v1(54.74,16.64)
  Bottom Layer w0.229: v1(5.79,63.12) 5.79,65.48 v1(5.84,65.53) ; v1(51.36,30.8) 52.32,29.85 53.13,29.85 54.66,28.32 v1(54.74,28.32) ; v1(53.09,37.08) 56.77,40.77 v1(56.77,43.43) ; v1(53.85,47.12) 53.85,49.4 54.99,50.55 v1(56.64,50.55) 55.5,51.69 34.67,51.69 v1(30.61,55.75) ; v1(54.74,16.64) 54.74,9.78 v1(52.2,7.24)
P3.7: length 124
  Top Layer w0.229: 63.22,6.19 SW6.1 50.99,9.32 v1(49.28,9.32) ; U28.12 26.34,61.54 29.72,58.17 v1(30.48,58.17) ; U1.17 RN2.9
  Bottom Layer w0.229: v1(49.28,9.32) 45.84,9.32 39.27,15.89 38.82,15.89 33.78,20.93 U7.2 28.13,26.61 28.13,55.82 v1(30.48,58.17) 36.92,58.17 38.55,59.8 39.48,59.8 42.04,62.36 54.36,62.36 63.63,53.09 U1.17
RST: length 51
  Top Layer w0.229: C1.2 17.04,40.53 26.04,40.53 SW1.3 v1(35.66,41.06)
  Bottom Layer w0.229: v1(35.66,41.06) 40.27,36.45 49.53,36.45 53.21,32.77 U1.9
RXD: length 48.7
  Top Layer w0.229: v1(41.4,23.88) 41.43,23.85 48.98,23.85 50.16,25.04 50.16,26.67 v1(56.99,33.5) ; U4.2 25.4,18.67 30.48,23.75 v1(35.05,23.75)
  Bottom Layer w0.229: v1(35.05,23.75) 41.27,23.75 v1(41.4,23.88) ; U1.10 62.2,33.5 v1(56.99,33.5)
TXD: length 48.3
  Top Layer w0.229: v1(56.15,33.46) 49.31,26.62 41.58,26.62 v1(41.53,26.67) ; U4.3 25.4,19.94 29.97,24.51 35.56,24.51 v1(37.66,26.61)
  Bottom Layer w0.229: v1(56.15,33.46) 59.84,37.15 63.31,37.15 U1.11 ; v1(41.53,26.67) 41.47,26.61 v1(37.66,26.61)
XTAL1: length 10.9
  Top Layer w0.229: U1.18 65.09,55.63 U2.2 66.99,57.61 67.93,58.55 72.67,58.55 73.15,59.03 X1.1
XTAL2: length 11.8
  Top Layer w0.229: X1.2 71.34,63.91 U3.1 65.59,58.17 U1.19
$1N343: length 30
  Top Layer w0.229: v1(28.7,47.5) 28.59,47.61 R2.1 ; v1(40.07,38.29) 43.05,35.31 U1.31
  Bottom Layer w0.229: v1(28.7,47.5) 34.42,41.78 36.58,41.78 v1(40.07,38.29)
$1N2430: length 5.8
  Top Layer w0.229: USB1.4 9.01,28.94 R5.1
$1N2431: length 5.5
  Top Layer w0.229: R6.1 9.76,25.94 USB1.10
$1N2434: length 11.7
  Top Layer w0.229: U4.5 22.35,22.48 20.45,24.38 15.37,24.38 13.45,26.31 R3.2
$1N2435: length 13.1
  Top Layer w0.229: U4.6 22.73,23.75 21.46,25.02 21.46,26.92 19.18,29.21 R4.2
$1N2436: length 7.5
  Top Layer w0.229: C4.1 24.57,21.21 U4.4
$1N2449: length 14.3
  Top Layer w0.229: C5.1 12,6.1 C6.2 C3.1 16.7,16.39 U4.16
$1N3085: length 8.5
  Top Layer w0.229: BUZ1.1 111.88,42 R7.1
$1N3747: length 2.2
  Top Layer w0.229: R8.2 LED1.1
$1N3748: length 2.3
  Top Layer w0.229: R9.2 98.55,39.24 LED2.1
$1N3749: length 2.1
  Top Layer w0.229: LED3.1 95.3,37.3 R10.2
$1N3750: length 2
  Top Layer w0.229: R11.2 LED4.1
$1N3751: length 2
  Top Layer w0.229: R12.2 88.7,37.32 LED5.1
$1N3752: length 1.8
  Top Layer w0.229: R13.2 LED6.1
$1N3753: length 2
  Top Layer w0.229: R14.2 81.66,37.23 LED7.1
$1N3754: length 2
  Top Layer w0.229: R15.2 78,37.35 LED8.1
$1N3965: length 18.8
  Top Layer w0.229: C7.1 20.64,76.26 19.05,77.85 19.05,83.06 17.82,84.29 X2.2 16.47,84.29 15.49,83.31 15.49,80.77 13.33,78.61 U8.2
$1N3966: length 15.3
  Top Layer w0.229: C8.1 21.21,83.82 19.14,85.89 X2.1 14.86,83.6 14.86,81.92 12.83,79.88 U8.3
$1N8435: length 24.5
  Top Layer w0.229: 109.73,55.3 R21.1 111.38,56.95 v1(111.38,58.17) ; 109.73,55.3 109.6,55.3 R19.2 ; 109.73,55.3 109.73,51.5 v1(112.24,48.99) ; v1(113.66,58.67) 115.32,60.33 U31.1
  Bottom Layer w0.229: v1(111.38,58.17) 111.89,58.67 v1(113.66,58.67) ; v1(112.24,48.99) 117.32,48.99 U33.2
$1N8496: length 11.4
  Top Layer w0.229: 112,52.45 112.95,53.41 U32.2 115.82,52.14 115.82,47.5 116.71,46.61 U33.3
$1N8550: length 17.6
  Top Layer w0.229: U31.2 114.09,63.18 R24.1 112.25,56.95 R21.2 113.46,55.37 116.59,55.37 117.47,54.48 U33.1
$1N8619: length 2.1
  Top Layer w0.229: LED9.2 110.45,64.14 R23.1
$1N9345: length 18.4
  Top Layer w0.229: v1(85.6,60.33) 85.6,54.36 80.64,49.4 U34.18 ; RN5.1 88.62,63.39 v1(88.26,63.02)
  Bottom Layer w0.229: v1(88.26,63.02) 88.26,62.99 v1(85.6,60.33)
$1N9349: length 17.8
  Top Layer w0.229: v1(87.4,62.97) 88.31,63.89 RN5.2 ; U34.17 80.52,50.67 84.84,54.99 v1(84.84,60.45)
  Bottom Layer w0.229: v1(84.84,60.45) 84.88,60.45 v1(87.4,62.97)
$1N9354: length 17.3
  Top Layer w0.229: v1(83.95,60.46) 83.95,55.37 80.52,51.94 U34.16 ; v1(86.51,62.97) 87.93,64.39 RN5.3
  Bottom Layer w0.229: v1(83.95,60.46) 84,60.46 v1(86.51,62.97)
$1N9359: length 17
  Top Layer w0.229: v1(85.6,62.87) 87.62,64.89 RN5.4 ; v1(83.19,60.45) 83.19,55.37 81.15,53.34 80.23,53.34 U34.15
  Bottom Layer w0.229: v1(85.6,62.87) 85.54,62.87 83.19,60.51 v1(83.19,60.45)
$1N9364: length 11.4
  Top Layer w0.229: RN6.1 80.15,63.39 v1(79.5,62.74) ; 79.25,54.48 v1(79.6,54.48)
  Bottom Layer w0.229: v1(79.6,54.48) 79.5,54.58 v1(79.5,62.74)
$1N9374: length 12.1
  Top Layer w0.229: RN6.2 79.47,63.89 v1(78.85,63.27) ; U34.13 78.98,55.75 v1(78.85,55.88)
  Bottom Layer w0.229: v1(78.85,55.88) 78.85,55.88 v1(78.85,63.27)
$1N9380: length 11.9
  Top Layer w0.229: U34.12 79.7,57.02 v1(78.1,58.61) ; v1(78.1,63.73) 78.77,64.39 78.87,64.39 78.87,64.39 RN6.3
  Bottom Layer w0.229: v1(78.1,63.73) v1(78.1,58.61)
$1N9386: length 12.1
  Top Layer w0.229: U34.11 79.85,58.29 v1(77.34,60.8) ; RN6.4 78.09,64.89 v1(77.34,64.14)
  Bottom Layer w0.229: v1(77.34,64.14) v1(77.34,60.8)
$1N9929: length 82.1
  Top Layer w0.229: v1(94.74,65.02) 93.1,63.39 RN5.8 ; v1(94.36,75.82) 94.36,82.17 95.38,83.19 95.38,84.84 92.77,87.44 47.31,87.44 44.7,84.84
  Bottom Layer w0.229: v1(94.36,75.82) 94.36,74.62 98.96,70.03 98.96,69.16 94.82,65.02 v1(94.74,65.02)
$1N9944: length 87.2
  Top Layer w0.229: v1(95.25,86.23) 104.14,86.23 105.54,84.84 105.54,82.85 101.81,79.12 v1(99.82,79.12) ; v1(92.07,86.23) 56.26,86.23 54.86,84.84 ; RN5.7 92.71,63.89 v1(93.85,65.02)
  Bottom Layer w0.229: v1(92.07,86.23) v1(95.25,86.23) ; v1(93.85,65.02) 96.42,67.59 96.42,70.21 92.96,73.66 92.96,76.45 95.63,79.12 v1(99.82,79.12)
$1N9973: length 66.9
  Top Layer w0.229: v1(93.19,65.44) 92.14,64.39 RN5.6 ; 100.46,69.6 97.47,66.61 v1(94.49,66.61) ; v1(96.61,73.28) 53.47,73.28 49.78,69.6
  Bottom Layer w0.229: v1(93.19,65.44) 94.36,66.61 v1(94.49,66.61) ; v1(96.61,73.28) 97.92,73.28 100.46,70.74 100.46,69.6
$1N9989: length 63.2
  Top Layer w0.229: v1(92.29,65.47) 91.7,64.89 RN5.5 ; v1(94.74,68.07) 95.38,68.71 95.38,69.6 ; v1(90.55,74.93) 50.04,74.93 44.7,69.6
  Bottom Layer w0.229: v1(90.55,74.93) 95.38,70.1 95.38,69.6 ; v1(94.74,68.07) 92.29,65.62 v1(92.29,65.47)
$1N10005: length 70
  Top Layer w0.229: 92.84,69.6 91.82,68.58 87.38,68.58 86.23,67.44 86.23,65.53 84.17,63.47 82.93,63.47 RN6.8 ; v1(86.87,75.57) 48.13,75.57 42.16,69.6
  Bottom Layer w0.229: v1(86.87,75.57) 88.01,75.57 92.84,70.74 92.84,69.6
$1N10021: length 82.6
  Top Layer w0.229: v1(85.72,71.5) 85.79,71.44 85.79,66.03 83.64,63.89 RN6.7 ; 97.92,84.84 97.92,84.33 v1(95.5,81.92) ; 47.24,84.84 49.28,86.87 v1(90.93,86.87) ; v1(93.6,80.9) 91.31,80.9 v1(87.5,77.09)
  Bottom Layer w0.229: v1(93.6,80.9) 94.49,80.9 v1(95.5,81.92) ; v1(87.5,77.09) 85.72,75.31 v1(85.72,71.5) ; v1(90.93,86.87) 97.03,86.87 97.92,85.98 97.92,84.84
$1N10037: length 76
  Top Layer w0.229: 52.32,69.6 53.21,69.6 56.26,72.64 v1(100.71,72.64) ; v1(87,66.04) 99.44,66.04 103,69.6 ; RN6.6 83.33,64.39 v1(84.97,66.03)
  Bottom Layer w0.229: v1(100.71,72.64) 100.76,72.64 103,70.4 103,69.6 ; v1(84.97,66.03) 84.99,66.04 v1(87,66.04)
$1N10053: length 71.8
  Top Layer w0.229: v1(85.22,67.25) RN6.5 ; 97.92,69.6 95.63,67.31 v1(87,67.31) ; v1(93.6,73.91) 51.56,73.91 47.24,69.6
  Bottom Layer w0.229: 97.92,69.6 97.92,70.48 94.48,73.91 v1(93.6,73.91) ; v1(85.22,67.25) 85.28,67.31 v1(87,67.31)

## Copper pours and planes (outline as drawn; the poured copper is in the pictures)
GND on Top Layer: 0.3,88.48 126.58,88.48 126.58,0.3 0.3,0.3
GND on Bottom Layer: 0.3,88.48 126.58,88.48 126.58,0.3 0.3,0.3
